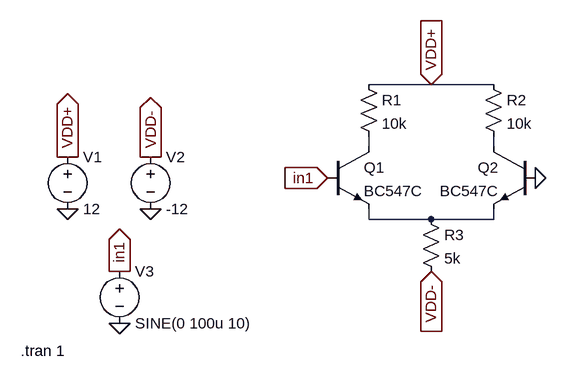
[diagram p0: schematic EW2_project2_diff_amp_iter2.asc]
EW2_project2_diff_amp_iter2.asc, the LTspice schematic file:
Version 4
SHEET 1 880 680
WIRE 160 16 64 16
WIRE 256 16 160 16
WIRE 64 112 64 96
WIRE 256 112 256 96
WIRE 64 224 64 208
WIRE 160 224 64 224
WIRE 256 224 256 208
WIRE 256 224 160 224
FLAG -272 208 0
FLAG -400 208 0
FLAG -320 384 0
FLAG 320 160 0
FLAG -400 128 VDD+
IOPIN -400 128 Out
FLAG -272 128 VDD-
IOPIN -272 128 Out
FLAG -320 304 in1
IOPIN -320 304 Out
FLAG 0 160 in1
IOPIN 0 160 In
FLAG 160 304 VDD-
IOPIN 160 304 In
FLAG 160 16 VDD+
IOPIN 160 16 In
SYMBOL npn 0 112 R0
SYMATTR InstName Q1
SYMATTR Value BC547C
SYMBOL npn 320 112 M0
SYMATTR InstName Q2
SYMATTR Value BC547C
SYMBOL voltage -400 112 R0
WINDOW 123 0 0 Left 0
WINDOW 39 0 0 Left 0
SYMATTR InstName V1
SYMATTR Value 12
SYMBOL voltage -272 112 R0
WINDOW 123 0 0 Left 0
WINDOW 39 0 0 Left 0
SYMATTR InstName V2
SYMATTR Value -12
SYMBOL voltage -320 288 R0
WINDOW 123 0 0 Left 0
WINDOW 39 0 0 Left 0
SYMATTR InstName V3
SYMATTR Value SINE(0 100u 10)
SYMBOL res 48 0 R0
SYMATTR InstName R1
SYMATTR Value 10k
SYMBOL res 240 0 R0
SYMATTR InstName R2
SYMATTR Value 10k
SYMBOL res 144 208 R0
SYMATTR InstName R3
SYMATTR Value 5k
TEXT -472 426 Left 2 !.tran 1

The netlist it stands for:
* EW2_project2_diff_amp_iter2.asc
Q1 N001 in1 N003 0 BC547C
Q2 N002 0 N003 0 BC547C
V1 VDD+ 0 12
V2 VDD- 0 -12
V3 in1 0 SINE(0 100u 10)
R1 VDD+ N001 10k
R2 VDD+ N002 10k
R3 N003 VDD- 5k
.model NPN NPN
.model PNP PNP
.lib standard.bjt
.tran 1
.backanno
.end